# EAGLE schematic All-in-one Starter Kit for Pico 2V 1.0(1) (EAGLE 9.5.1)
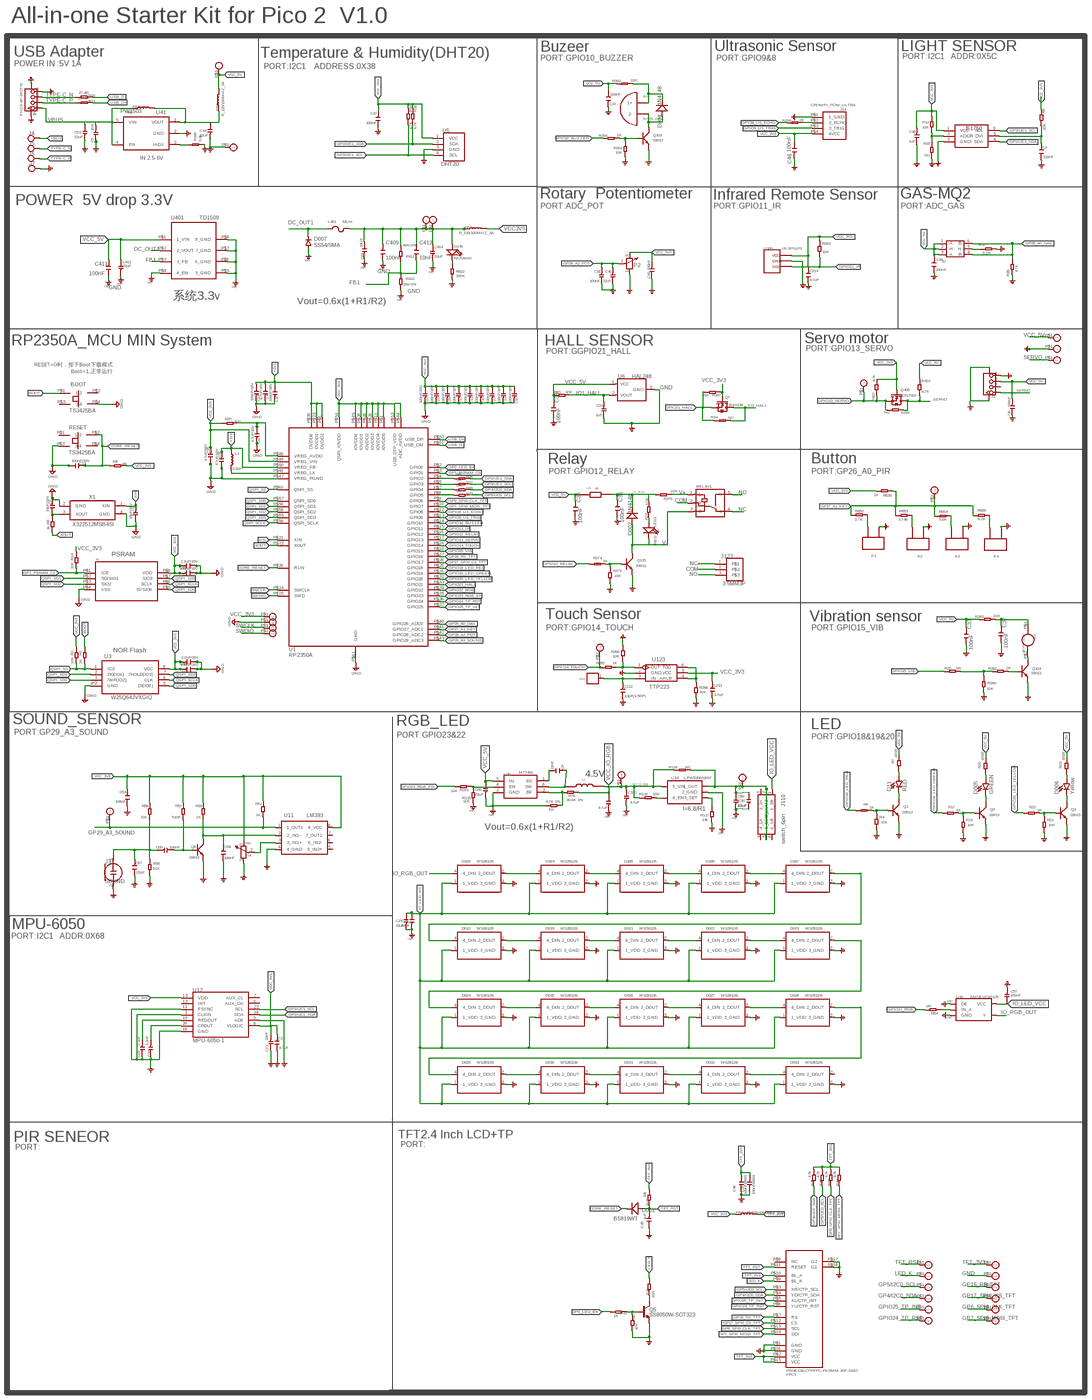
[diagram p0: schematic, sheet 1, overview]
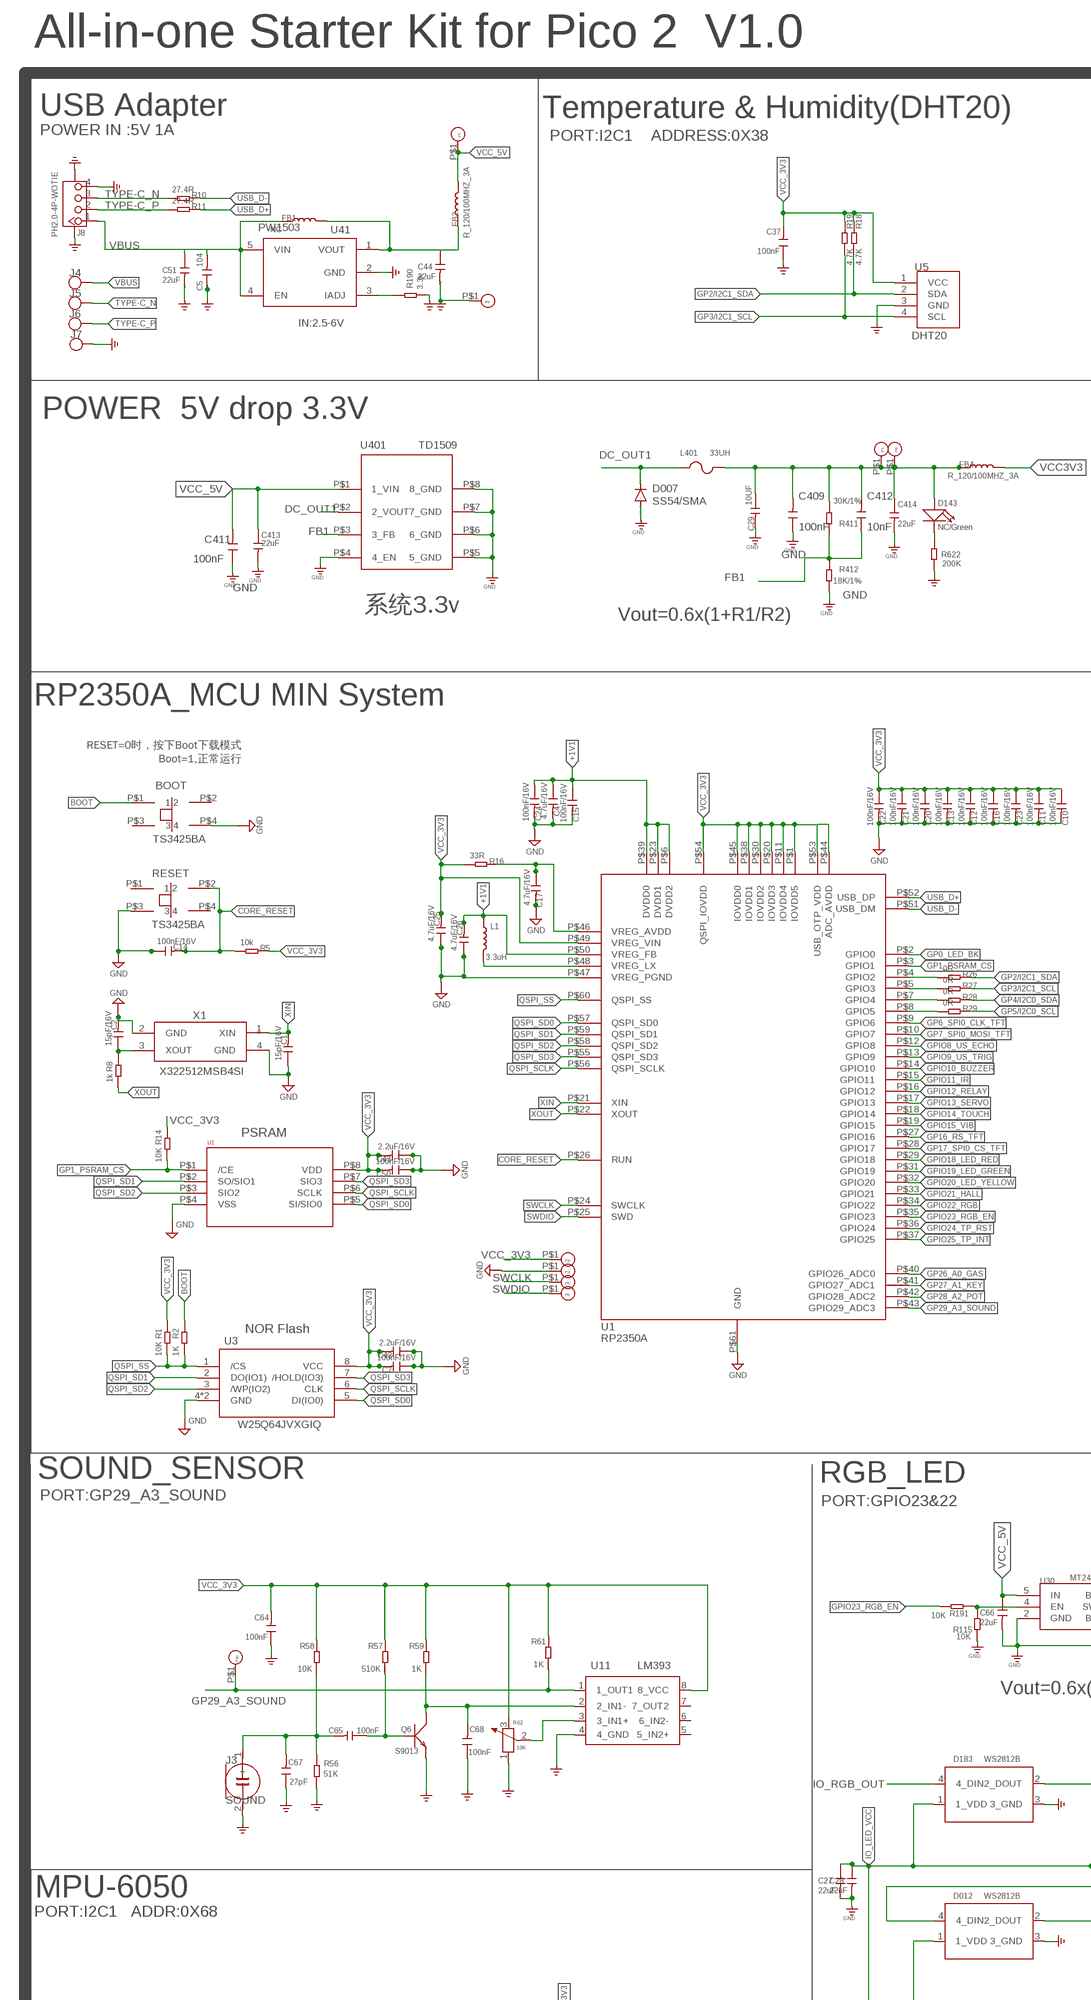
[diagram p1: schematic, sheet 1, part 1 of 4]
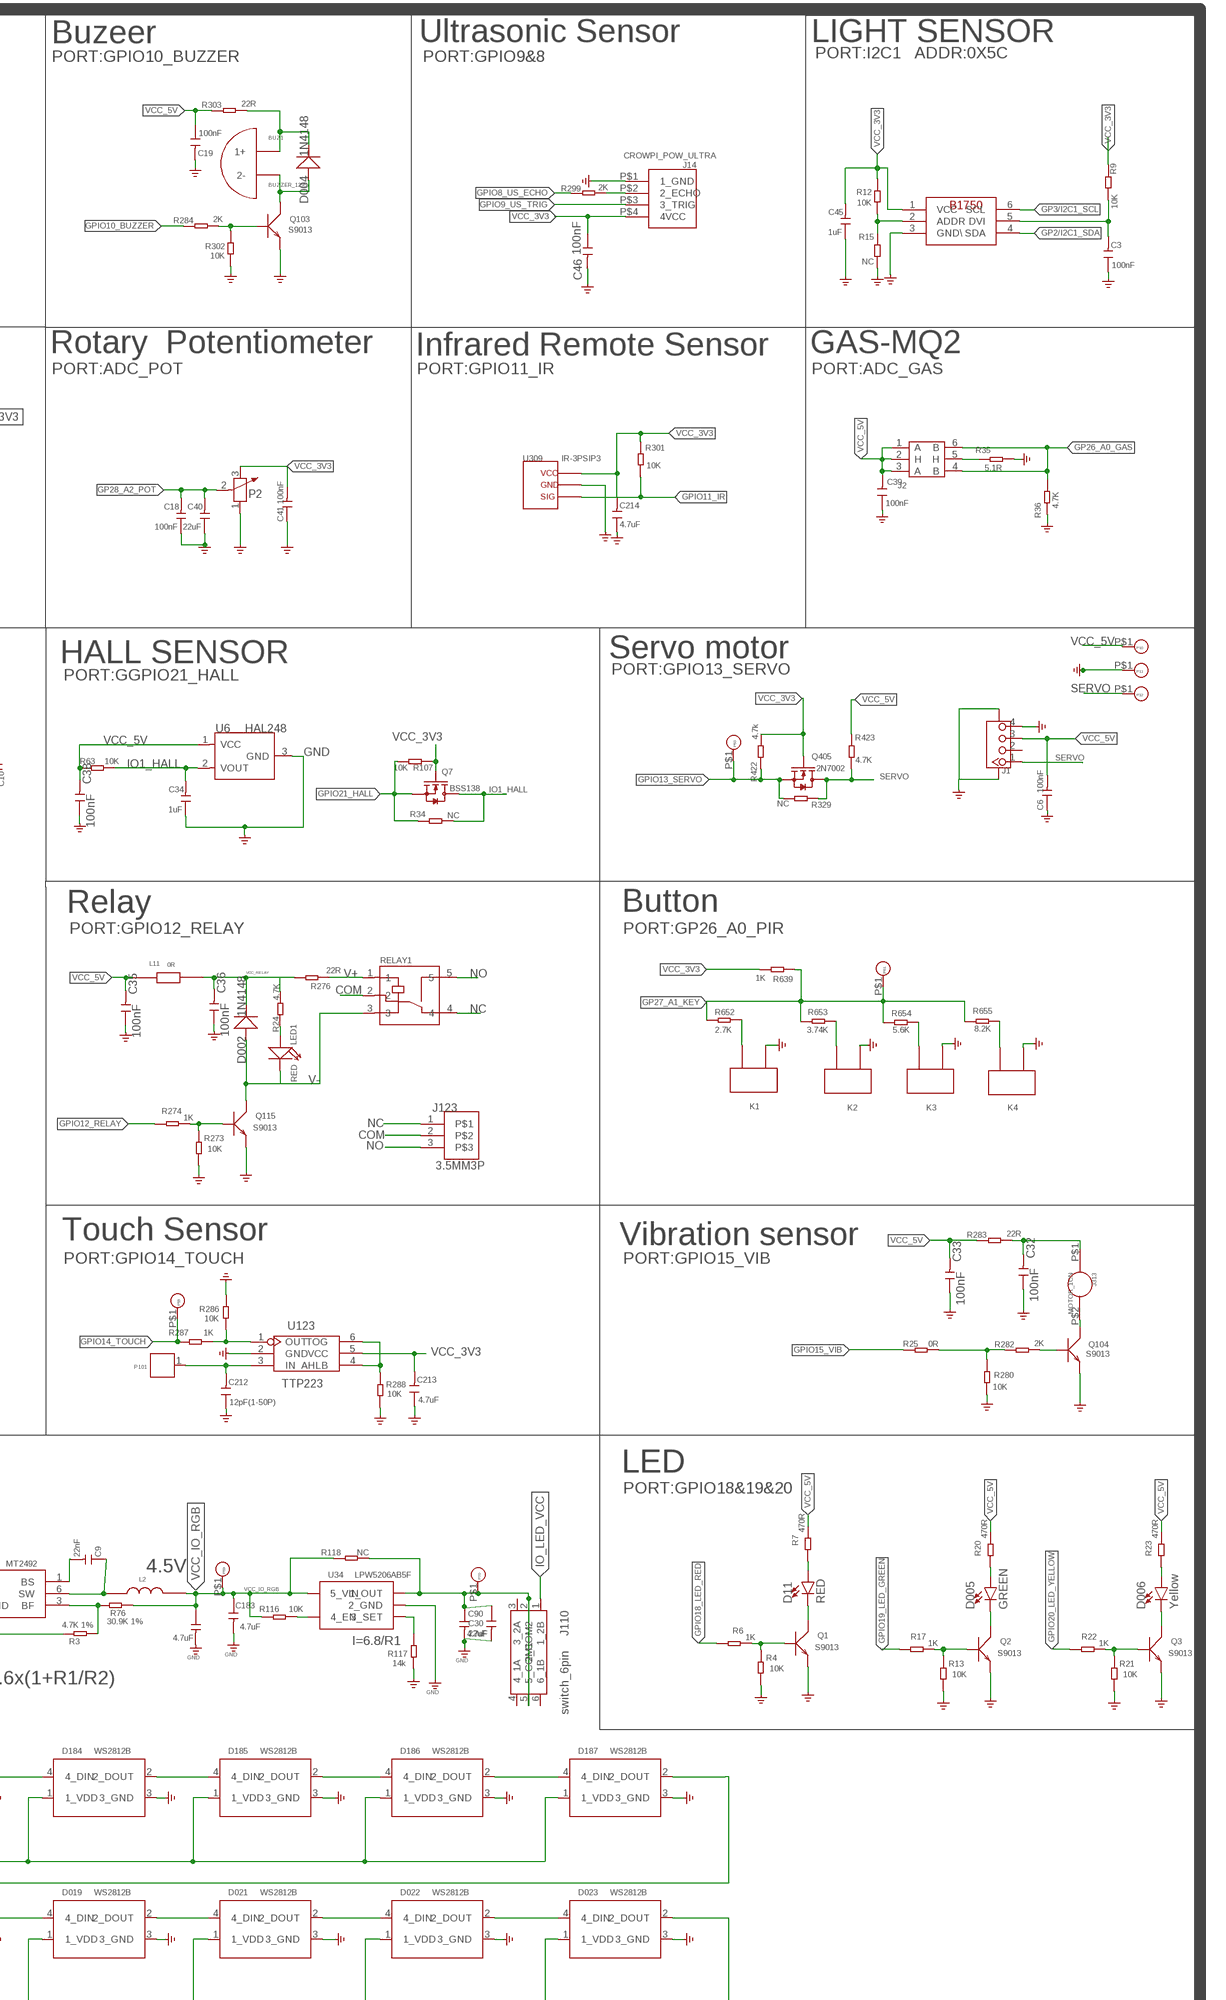
[diagram p2: schematic, sheet 1, part 2 of 4]
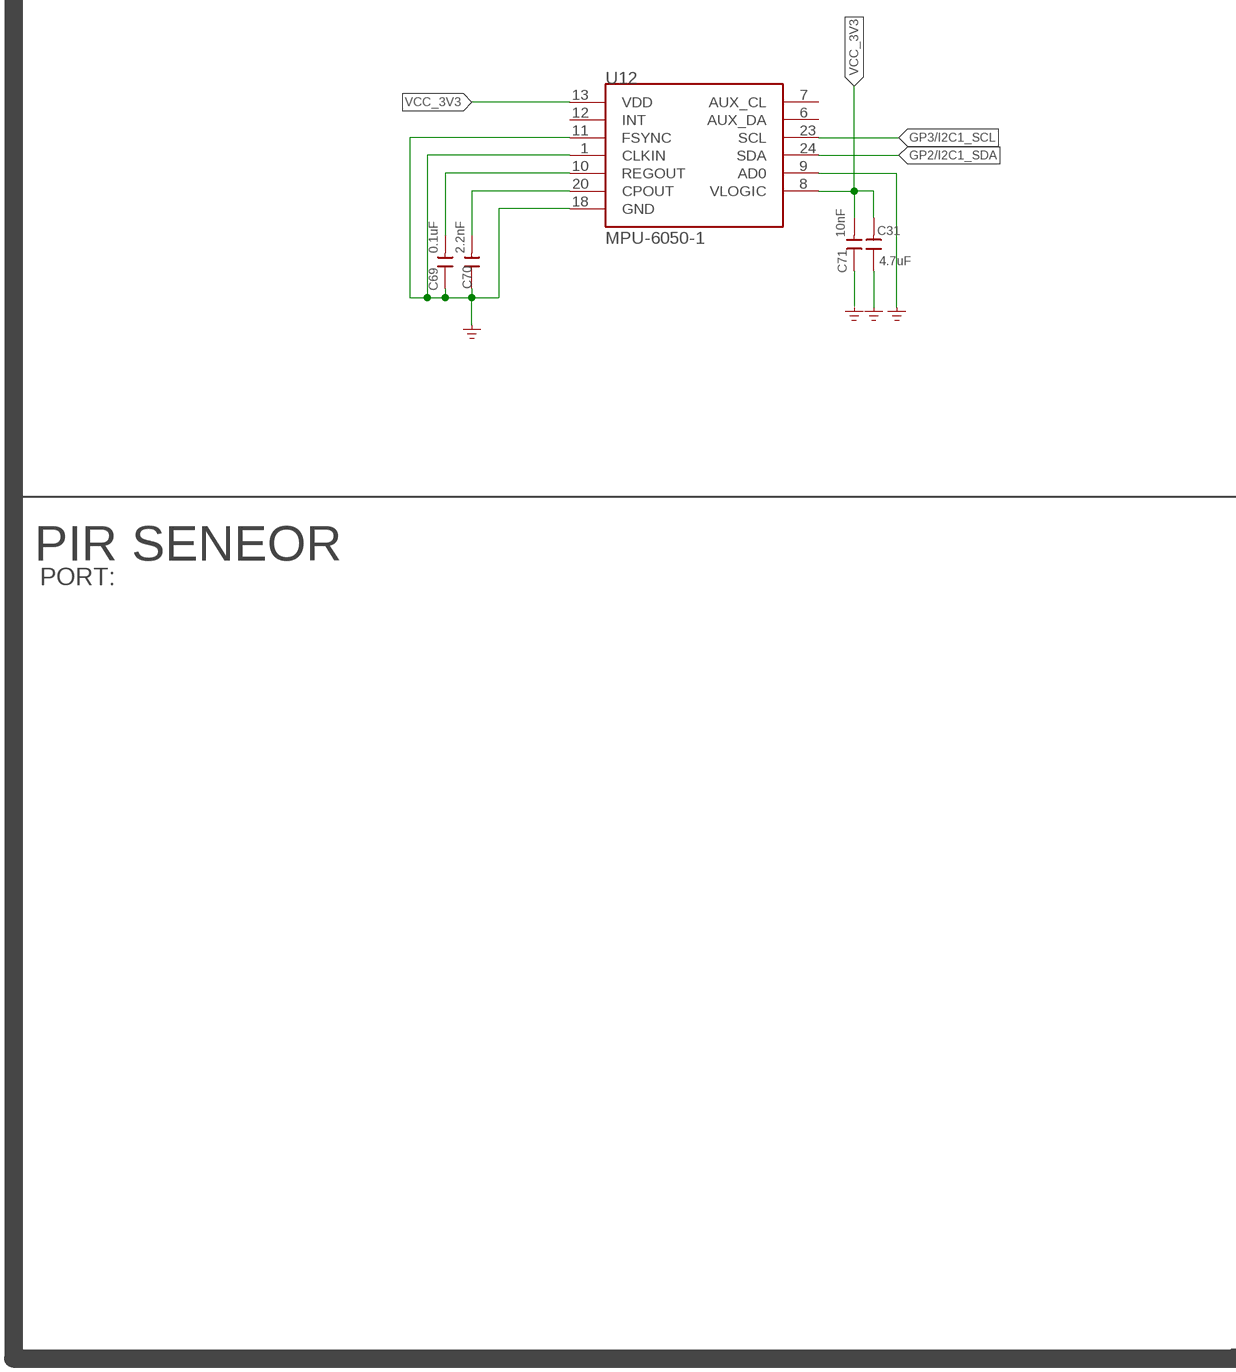
[diagram p3: schematic, sheet 1, part 3 of 4]
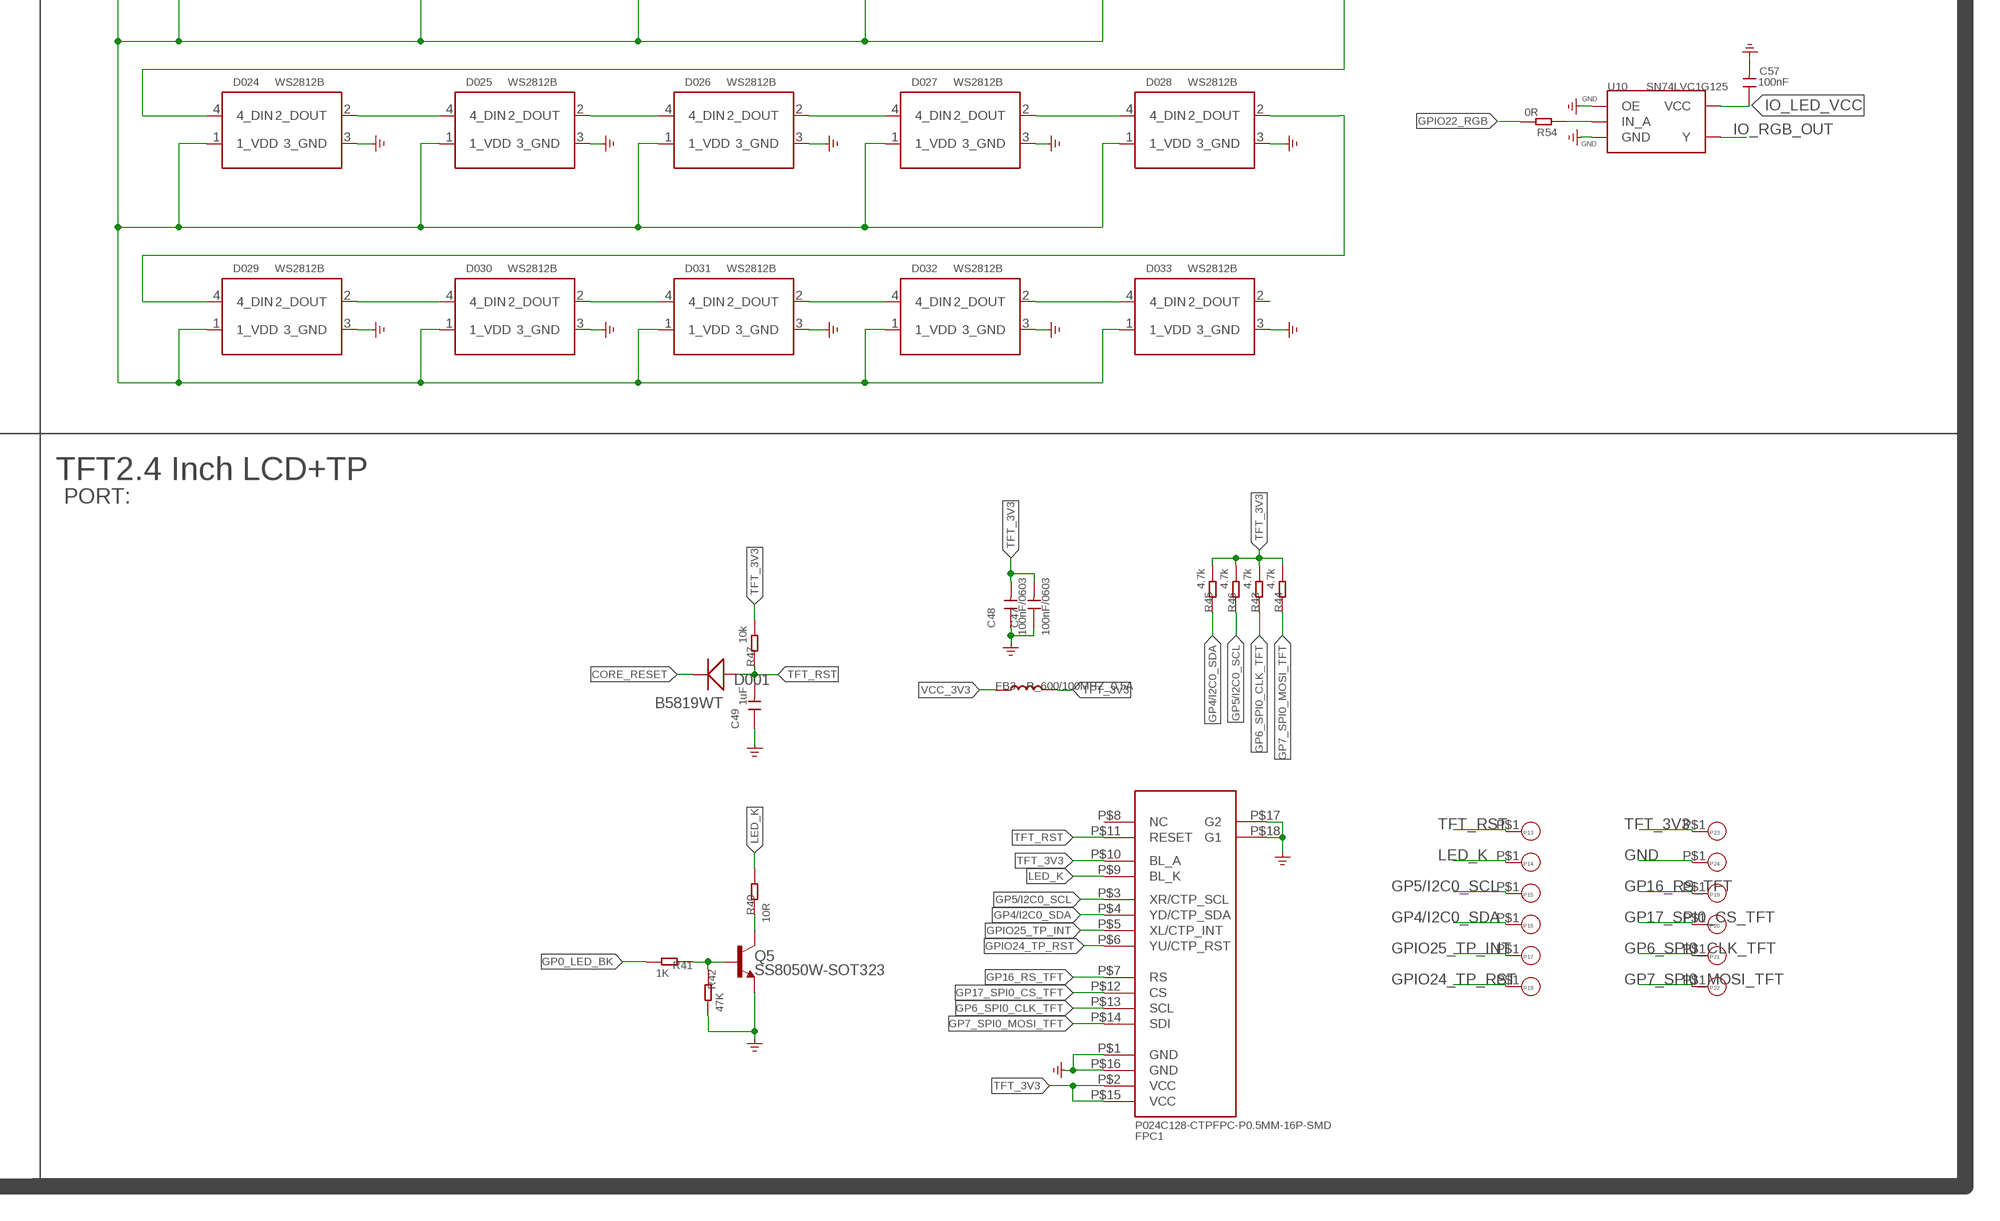
[diagram p4: schematic, sheet 1, part 4 of 4]

## Parts
BOOT  TS3425BA  KEY  [SMD_KEY4.2*3.*.2.5]
BUZ1  BUZZER_1295  BUZZERBUZZER_1295_DIP  [BUZZER-D12MM-DIP2]
C1  15pF/16V  CAPC0603  [C0603]
C2  15pF/16V  CAPC0603  [C0603]
C3  100nF  CAPC0603  [C0603]
C4  4.7uF/16V  CAPC0603  [C0603]
C5  104  CAPC0805  [C0805]
C6  100nF  CAPC0603  [C0603]
C7  100nF/16V  CAPC0603  [C0603]
C8  4.7uF  CAPC0603  [C0603]
C9  22nF  CAPC0603  [C0603]
C10  100nF/16V  CAPC0603  [C0603]
C11  100nF/16V  CAPC0603  [C0603]
C12  100nF/16V  CAPC0603  [C0603]
C13  100nF/16V  CAPC0603  [C0603]
C14  100nF/16V  CAPC0603  [C0603]
C15  100nF/16V  CAPC0603  [C0603]
C16  100nF/16V  CAPC0603  [C0603]
C17  4.7uF/16V  CAPC0603  [C0603]
C18  100nF  CAPC0603  [C0603]
C19  100nF  CAPC0603  [C0603]
C20  100nF/16V  CAPC0603  [C0603]
C21  100nF/16V  CAPC0603  [C0603]
C22  100nF/16V  CAPC0603  [C0603]
C23  100nF/16V  CAPC0603  [C0603]
C24  100nF/16V  CAPC0603  [C0603]
C25  4.7uF/16V  CAPC0603  [C0603]
C26  4.7uF/16V  CAPC0603  [C0603]
C27  22uF  CAPC0805  [C0805]
C28  22uF  CAPC0805  [C0805]
C29  10UF  CAPC0805  [C0805]
C30  22uF  CAPC0805  [C0805]
C31  4.7uF  CAPC0603  [C0603]
C32  100nF  CAPC0603  [C0603]
C33  100nF  CAPC0603  [C0603]
C34  1uF  CAPC0603  [C0603]
C35  100nF  CAPC0603  [C0603]
C36  100nF  CAPC0603  [C0603]
C37  100nF  CAPC0603  [C0603]
C38  100nF  CAPC0603  [C0603]
C39  100nF  CAPC0603  [C0603]
C40  22uF  CAPC0603  [C0603]
C41  100nF  CAPC0603  [C0603]
C42  2.2uF/16V  CAPC0603  [C0603]
C43  2.2uF/16V  CAPC0603  [C0603]
C44  22uF  CAPC0805  [C0805]
C45  1uF  CAPC0603  [C0603]
C46  100nF  CAPC0603  [C0603]
C47  100nF/0603  CAPC0603  [C0603]
C48  100nF/0603  CAPC0603  [C0603]
C49  1uF  CAPC0603  [C0603]
C50  100nF/16V  CAPC0603  [C0603]
C51  22uF  CAPC0805  [C0805]
C57  100nF  CAPC0603  [C0603]
C64  100nF  CAPC0603  [C0603]
C65  100nF  CAPC0603  [C0603]
C66  22uF  CAPC0805  [C0805]
C67  27pF  CAPC0603  [C0603]
C68  100nF  CAPC0603  [C0603]
C69  0.1uF  CAPC0603  [C0603]
C70  2.2nF  CAPC0603  [C0603]
C71  10nF  CAPC0603  [C0603]
C90  4.7uF  CAPC0603  [C0603]
C183  4.7uF  CAPC0603  [C0603]
C212  12pF(1-50P)  CAPC0603  [C0603]
C213  4.7uF  CAPC0603  [C0603]
C214  4.7uF  CAPC0603  [C0603]
C409  100nF  CAPC0603  [C0603]
C411  100nF  CAPC0603  [C0603]
C412  10nF  CAPC0603  [C0603]
C413  22uF  CAPC0805  [C0805]
C414  22uF  CAPC0805  [C0805]
D001  B5819WT  DIODE0603  [D_SOD523]
D002  1N4148  DIODE1206  [D_SOD123]
D004  1N4148  DIODE1206  [D_SOD123]
D005  GREEN  LED  [LED-8MM]
D006  Yellow  LED  [LED-8MM]
D007  SS54/SMA  DIODE_DIODE-DO-214AC  [DIODE_DO-214AC]
D11  RED  LED  [LED-8MM]
D012  WS2812B  LED_RGB_WS2812_3535  [LED_RGB_WS2812_3535]
D019  WS2812B  LED_RGB_WS2812_3535  [LED_RGB_WS2812_3535]
D021  WS2812B  LED_RGB_WS2812_3535  [LED_RGB_WS2812_3535]
D022  WS2812B  LED_RGB_WS2812_3535  [LED_RGB_WS2812_3535]
D023  WS2812B  LED_RGB_WS2812_3535  [LED_RGB_WS2812_3535]
D024  WS2812B  LED_RGB_WS2812_3535  [LED_RGB_WS2812_3535]
D025  WS2812B  LED_RGB_WS2812_3535  [LED_RGB_WS2812_3535]
D026  WS2812B  LED_RGB_WS2812_3535  [LED_RGB_WS2812_3535]
D027  WS2812B  LED_RGB_WS2812_3535  [LED_RGB_WS2812_3535]
D028  WS2812B  LED_RGB_WS2812_3535  [LED_RGB_WS2812_3535]
D029  WS2812B  LED_RGB_WS2812_3535  [LED_RGB_WS2812_3535]
D030  WS2812B  LED_RGB_WS2812_3535  [LED_RGB_WS2812_3535]
D031  WS2812B  LED_RGB_WS2812_3535  [LED_RGB_WS2812_3535]
D032  WS2812B  LED_RGB_WS2812_3535  [LED_RGB_WS2812_3535]
D033  WS2812B  LED_RGB_WS2812_3535  [LED_RGB_WS2812_3535]
D143  NC/Green  LED_0603_SMT  [LED_0603_SMT]
D183  WS2812B  LED_RGB_WS2812_3535  [LED_RGB_WS2812_3535]
D184  WS2812B  LED_RGB_WS2812_3535  [LED_RGB_WS2812_3535]
D185  WS2812B  LED_RGB_WS2812_3535  [LED_RGB_WS2812_3535]
D186  WS2812B  LED_RGB_WS2812_3535  [LED_RGB_WS2812_3535]
D187  WS2812B  LED_RGB_WS2812_3535  [LED_RGB_WS2812_3535]
FB1  NC  R_120/100MHZ_3A  [L0805]
FB2  R_120/100MHZ_3A  [L0805]
FB3  R_600/100MHZ_0.5A  [L0603]
FB4  R_120/100MHZ_3A  [L0805]
FPC1  P024C128-CTPFPC-P0.5MM-16P-SMD  [FPC-P0.5MM-16P-SMD]
J1  A_XBJ_CONNECTOR_TWIG-4P-2.0-SMD-FEMALE-REINFORCE90D  [A_XBJ_CONNECTOR_4P-SMD-2.0-90D]
J2  MQ-SOCKET  [MQ2]
J3  SOUND  TEMPLATE_MICROPHONE  [TEMPLATE_2P-D8.9MM]
J4  TP-SMDTP-SMD-2X4MM  [TP-SMD-2X4MM]
J5  TP-SMDTP-SMD-2X4MM  [TP-SMD-2X4MM]
J6  TP-SMDTP-SMD-2X4MM  [TP-SMD-2X4MM]
J7  TP-SMDTP-SMD-2X4MM  [TP-SMD-2X4MM]
J8  PH2.0-4P-WOTIE  [PH2.0-4P]
J14  CROWPI_POW_ULTRA  [CROWPI_POW_ULTRA]
J110  switch_6pin  SWITCH_6PIN_2P  [SWITCH_6PIN_2P]
J123  3.5MM3P  [3.5MM*3P]
J313  MOTOR_1CN  [MOTOR_1CM]
K1  BUTTON_2P  [BUTTON_2P]
K2  BUTTON_2P  [BUTTON_2P]
K3  BUTTON_2P  [BUTTON_2P]
K4  BUTTON_2P  [BUTTON_2P]
L1  3.3uH  FTC201610S3R3MBCA  [SMD,1.6X2MM]
L2  CD32_950MA  [CD32]
L11  0R  CMP201209UD1R0MT201209  [201209]
L401  33UH  L-773  [L773]
LED1  RED  DISCRETE_LED0603  [DISCRETE_LED-0603]
P1  PADPAD-1.0MM  [PAD-1.0MM]
P2  R-POTENTIOMETER  [3P-SQUA-45.6X10X5.8H]
P3  PADPAD-1.0MM  [PAD-1.0MM]
P4  PADPAD-1.0MM  [PAD-1.0MM]
P5  PADPAD-1.0MM  [PAD-1.0MM]
P6  PADPAD-1.0MM  [PAD-1.0MM]
P7  PADPAD-1.0MM  [PAD-1.0MM]
P8  PADPAD-1.0MM  [PAD-1.0MM]
P9  PADPAD-1.0MM  [PAD-1.0MM]
P10  PADPAD-1.0MM  [PAD-1.0MM]
P11  PADPAD-1.0MM  [PAD-1.0MM]
P12  PADPAD-1.0MM  [PAD-1.0MM]
P13  PADPAD-1.0MM  [PAD-1.0MM]
P14  PADPAD-1.0MM  [PAD-1.0MM]
P15  PADPAD-1.0MM  [PAD-1.0MM]
P16  PADPAD-1.0MM  [PAD-1.0MM]
P17  PADPAD-1.0MM  [PAD-1.0MM]
P18  PADPAD-1.0MM  [PAD-1.0MM]
P19  PADPAD-1.0MM  [PAD-1.0MM]
P20  PADPAD-1.0MM  [PAD-1.0MM]
P21  PADPAD-1.0MM  [PAD-1.0MM]
P22  PADPAD-1.0MM  [PAD-1.0MM]
P23  PADPAD-1.0MM  [PAD-1.0MM]
P24  PADPAD-1.0MM  [PAD-1.0MM]
P30  PADPAD-1.0MM  [PAD-1.0MM]
P53  PADPAD-1.0MM  [PAD-1.0MM]
P55  PADPAD-1.0MM  [PAD-1.0MM]
P61  PADPAD-1.0MM  [PAD-1.0MM]
P69  PADPAD-1.0MM  [PAD-1.0MM]
P70  PADPAD-1.0MM  [PAD-1.0MM]
P101  KEY  PAD'D450MIL'  [1P-D450]
Q1  S9013  TRANSISTOR-NPN-SOT23  [SOT23@1]
Q2  S9013  TRANSISTOR-NPN-SOT23  [SOT23@1]
Q3  S9013  TRANSISTOR-NPN-SOT23  [SOT23@1]
Q5  SS8050W-SOT323  TRANS_NPN  [MOS_SOT323]
Q6  S9013  TRANSISTOR-NPN-SOT23  [SOT23@1]
Q7  BSS138  MOSFET-N'SOT23'  [SOT23]
Q103  S9013  TRANSISTOR-NPN-SOT23  [SOT23@1]
Q104  S9013  TRANSISTOR-NPN-SOT23  [SOT23@1]
Q115  S9013  TRANSISTOR-NPN-SOT23  [SOT23@1]
Q405  2N7002  MOSFET-N'SOT23'  [SOT23]
R1  10K  RESR0603  [R0603]
R2  1K  RESR0603  [R0603]
R3  4.7K 1%  RESR0603  [R0603]
R4  10K  RESR0603  [R0603]
R5  10k  RESR0603  [R0603]
R6  1K  RESR0603  [R0603]
R7  470R  RESR0603  [R0603]
R8  1k  RESR0603  [R0603]
R9  10K  RESR0603  [R0603]
R10  27.4R  RESR0603  [R0603]
R11  27.4R  RESR0603  [R0603]
R12  10K  RESR0603  [R0603]
R13  10K  RESR0603  [R0603]
R14  10K  RESR0603  [R0603]
R15  NC  RESR0603  [R0603]
R16  33R  RESR0603  [R0603]
R17  1K  RESR0603  [R0603]
R18  4.7K  RESR0603  [R0603]
R19  4.7K  RESR0603  [R0603]
R20  470R  RESR0603  [R0603]
R21  10K  RESR0603  [R0603]
R22  1K  RESR0603  [R0603]
R23  470R  RESR0603  [R0603]
R24  4.7K  RESR0603  [R0603]
R25  0R  RESR0603  [R0603]
R26  0R  RESR0603  [R0603]
R27  0R  RESR0603  [R0603]
R28  0R  RESR0603  [R0603]
R29  0R  RESR0603  [R0603]
R34  NC  RESR0603  [R0603]
R35  5.1R  RESR0603  [R0603]
R36  4.7K  RESR0603  [R0603]
R40  10R  RESR0603  [R0603]
R41  1K  RESR0603  [R0603]
R42  47K  RESR0603  [R0603]
R43  4.7k  RESR0603  [R0603]
R44  4.7k  RESR0603  [R0603]
R45  4.7k  RESR0603  [R0603]
R46  4.7k  RESR0603  [R0603]
R47  10k  RESR0603  [R0603]
R54  0R  RESR0603  [R0603]
R56  51K  RESR0603  [R0603]
R57  510K  RESR0603  [R0603]
R58  10K  RESR0603  [R0603]
R59  1K  RESR0603  [R0603]
R61  1K  RESR0603  [R0603]
R62  10K  R-POTENTIOMETER-SMD  [3P-SMD-SQUA-3.6X3.3]
R63  10K  RESR0603  [R0603]
R76  30.9K 1%  RESR0603  [R0603]
R107  10K  RESR0603  [R0603]
R115  10K  RESR0603  [R0603]
R116  10K  RESR0603  [R0603]
R117  14k  RESR0603  [R0603]
R118  NC  RESR0603  [R0603]
R190  3.3k  RESR0603  [R0603]
R191  10K  RESR0603  [R0603]
R273  10K  RESR0603  [R0603]
R274  1K  RESR0603  [R0603]
R276  22R  RESR0603  [R0603]
R280  10K  RESR0603  [R0603]
R282  2K  RESR0603  [R0603]
R283  22R  RESR0603  [R0603]
R284  2K  RESR0603  [R0603]
R286  10K  RESR0603  [R0603]
R287  1K  RESR0603  [R0603]
R288  10K  RESR0603  [R0603]
R299  2K  RESR0603  [R0603]
R301  10K  RESR0603  [R0603]
R302  10K  RESR0603  [R0603]
R303  22R  RESR0603  [R0603]
R329  NC  RESR0603  [R0603]
R411  30K/1%  RESR0603  [R0603]
R412  18K/1%  RESR0603  [R0603]
R422  4.7k  RESR0603  [R0603]
R423  4.7K  RESR0603  [R0603]
R622  200K  RESR0603  [R0603]
R639  1K  RESR0603  [R0603]
R652  2.7K  RESR0603  [R0603]
R653  3.74K  RESR0603  [R0603]
R654  5.6K  RESR0603  [R0603]
R655  8.2K  RESR0603  [R0603]
RELAY1  RELAY-SRD  [REY5-6-19.1X15.5X15.3MM]
RESET  TS3425BA  KEY  [SMD_KEY4.2*3.*.2.5]
U1  RP2350A  [QFN-60_7X7MM]
U2  APS6404L  [SOP-8L]
U3  W25Q64JVXGIQ  W25QXX  [W25QXX-XSON-8-EP(4X4)]
U5  DHT20  CROWTAIL-DHT20-V1.0-20211013_DHT20  [CROWTAIL-DHT20-V1.0-20211013_DHT20]
U6  HAL248  A1101  [SOT-23W]
U7  BH1750  [BH1750-WSOF-6]
U10  SN74LVC1G125  [SOT23-5]
U11  LM393  IC_LM393_SOP8  [SOP8@1]
U12  MPU-6050-1  [QFN-24-4MM2]
U30  MT2492  [MT2492-SOT23-6]
U34  LPW5206AB5F  LPW5206B5F_SOT23-5  [IC_SOT23-5]
U41  PW1503  [SOT23-5]
U123  TTP223  [SOT23-6L]
U309  IR-3PSIP3  [VS1838B-SIP3]
U401  TD1509  [TD1509]
X1  X322512MSB4SI  A_XBJ_XTAL  [A_XBJ_SMD3225]

## Nets
+1V1 [PWR]: C4.1 C15.1 C24.1 C26.2 L1.P$1 U1.P$6(DVDD2) U1.P$23(DVDD1) U1.P$39(DVDD0) U1.P$50(VREG_FB)
BOOT: BOOT.P$1 R2.2
COM: J123.2 RELAY1.2
CORE_RESET: C14.2 D001.- R5.1 RESET.P$2 U1.P$26(RUN)
DC_OUT1 [PWR]: D007.C L401.1 U401.P$2(2_VOUT)
FB1: C412.1 R411.1 R412.2 U401.P$3(3_FB)
GND [PWR]: BOOT.P$4 C1.1 C2.2 C3.1 C4.2 C5.1 C6.1 C7.1 C8.2 C10.2 C11.2 C12.2 C13.2 C14.1 C15.2 C16.2 C17.2 C18.1 C19.2 C20.2 C21.2 C22.2 C23.2 C24.2 C25.1 C26.1 C27.2 C28.2 C29.2 C30.2 C31.1 C32.1 C33.1 C34.1 C35.1 C36.1 C37.1 C38.1 C39.1 C40.1 C41.1 C42.1 C43.1 C44.2 C45.1 C46.2 C47.1 C48.1 C49.1 C50.1 C51.2 C57.2 C64.1 C66.2 C67.1 C68.1 C69.1 C70.1 C71.1 C90.2 C183.2 C212.1 C213.1 C214.1 C409.1 C411.1 C413.2 C414.2 D007.A D012.3(3_GND) D019.3(3_GND) D021.3(3_GND) D022.3(3_GND) D023.3(3_GND) D024.3(3_GND) D025.3(3_GND) D026.3(3_GND) D027.3(3_GND) D028.3(3_GND) D029.3(3_GND) D030.3(3_GND) D031.3(3_GND) D032.3(3_GND) D033.3(3_GND) D183.3(3_GND) D184.3(3_GND) D185.3(3_GND) D186.3(3_GND) D187.3(3_GND) FPC1.P$1(GND) FPC1.P$16(GND) FPC1.P$17(G2) FPC1.P$18(G1) J1.4 J1.SS1 J1.SS2 J3.2(-) J7.1 J8.4 J8.5(SS1) J8.6(SS2) J14.P$1(1_GND) K1.P$1 K2.P$1 K3.P$1 K4.P$1 P2.1 P4.P$1 P9.P$1 P11.P$1 P24.P$1 Q1.2(E) Q2.2(E) Q3.2(E) Q5.2(E) Q6.2(E) Q103.2(E) Q104.2(E) Q115.2(E) R3.1 R4.1 R13.1 R15.1 R21.1 R35.1 R36.2 R42.2 R56.2 R62.1 R115.2 R117.2 R190.2 R273.1 R280.1 R286.2 R288.2 R302.1 R412.1 R622.2 RESET.P$3 U1.P$47(VREG_PGND) U1.P$61(GND) U2.P$4(VSS) U3.4(GND) U3.EP(GND) U5.3(GND) U6.3(GND) U7.3(GND\) U10.1(OE) U10.3(GND) U11.4(4_GND) U12.1(CLKIN) U12.9(AD0) U12.11(FSYNC) U12.18(GND) U30.2(GND) U34.2(2_GND) U41.2(GND) U123.2(GND) U309.2 U401.P$4(4_EN) U401.P$5(5_GND) U401.P$6(6_GND) U401.P$7(7_GND) U401.P$8(8_GND) X1.2(GND) X1.4(GND) ; supply symbol labelled POWER-OR-GND-_GND_POWER
GP0_LED_BK: R41.2 U1.P$2(GPIO0)
GP1_PSRAM_CS: R14.1 U1.P$3(GPIO1) U2.P$1(/CE)
GP2/I2C1_SDA: R18.2 R26.2 U5.2(SDA) U7.4(SDA) U12.24(SDA)
GP3/I2C1_SCL: R19.2 R27.2 U5.4(SCL) U7.6(SCL) U12.23(SCL)
GP4/I2C0_SDA: FPC1.P$4(YD/CTP_SDA) P16.P$1 R28.2 R45.1
GP5/I2C0_SCL: FPC1.P$3(XR/CTP_SCL) P15.P$1 R29.2 R46.1
GP6_SPI0_CLK_TFT: FPC1.P$13(SCL) P21.P$1 R43.1 U1.P$9(GPIO6)
GP7_SPI0_MOSI_TFT: FPC1.P$14(SDI) P22.P$1 R44.1 U1.P$10(GPIO7)
GP16_RS_TFT: FPC1.P$7(RS) P19.P$1 U1.P$27(GPIO16)
GP17_SPI0_CS_TFT: FPC1.P$12(CS) P20.P$1 U1.P$28(GPIO17)
GP26_A0_GAS: J2.4(B) J2.6(B) R36.1 U1.P$40(GPIO26_ADC0)
GP27_A1_KEY: P61.P$1 R639.2 R652.2 R653.2 R654.2 R655.2 U1.P$41(GPIO27_ADC1)
GP28_A2_POT: C18.2 C40.2 P2.2 U1.P$42(GPIO28_ADC2)
GP29_A3_SOUND: P30.P$1 R61.1 U1.P$43(GPIO29_ADC3) U11.1(1_OUT1)
GPIO8_US_ECHO: R299.2 U1.P$12(GPIO8)
GPIO9_US_TRIG: J14.P$3(3_TRIG) U1.P$13(GPIO9)
GPIO10_BUZZER: R284.1 U1.P$14(GPIO10)
GPIO11_IR: R301.2 U1.P$15(GPIO11) U309.3
GPIO12_RELAY: R274.2 U1.P$16(GPIO12)
GPIO13_SERVO: P53.P$1 Q405.2(S) R329.2 R422.1 U1.P$17(GPIO13)
GPIO14_TOUCH: P55.P$1 R287.2 U1.P$18(GPIO14)
GPIO15_VIB: R25.2 U1.P$19(GPIO15)
GPIO18_LED_RED: R6.2 U1.P$29(GPIO18)
GPIO19_LED_GREEN: R17.2 U1.P$31(GPIO19)
GPIO20_LED_YELLOW: R22.2 U1.P$32(GPIO20)
GPIO21_HALL: Q7.2(S) R34.1 R107.1 U1.P$33(GPIO21)
GPIO22_RGB: R54.1 U1.P$34(GPIO22)
GPIO23_RGB_EN: R191.1 U1.P$35(GPIO23)
GPIO24_TP_RST: FPC1.P$6(YU/CTP_RST) P18.P$1 U1.P$36(GPIO24)
GPIO25_TP_INT: FPC1.P$5(XL/CTP_INT) P17.P$1 U1.P$37(GPIO25)
IN1: C212.2 P101.1 U123.3(IN)
IO0_VIB: R25.1 R280.2 R282.1
IO1_HALL: C34.2 Q7.3(D) R34.2 R63.1 U6.2(VOUT)
IO_LED_V [PWR]: C30.1 C90.1 J110.2(2_COM2) J110.5(5_COM1) P70.P$1 R118.2 U34.1(1_OUT)
IO_LED_VCC [PWR]: C27.1 C28.1 C57.1 D012.1(1_VDD) D019.1(1_VDD) D021.1(1_VDD) D022.1(1_VDD) D023.1(1_VDD) D024.1(1_VDD) D025.1(1_VDD) D026.1(1_VDD) D027.1(1_VDD) D028.1(1_VDD) D029.1(1_VDD) D030.1(1_VDD) D031.1(1_VDD) D032.1(1_VDD) D033.1(1_VDD) D183.1(1_VDD) D184.1(1_VDD) D185.1(1_VDD) D186.1(1_VDD) D187.1(1_VDD) J110.1(1_2B) U10.5(VCC)
IO_RGB_OUT: D183.4(4_DIN) U10.4(Y)
IO_RGB_OUT1: D012.4(4_DIN) D187.2(2_DOUT)
IO_RGB_OUT2: D023.2(2_DOUT) D024.4(4_DIN)
IO_RGB_OUT3: D028.2(2_DOUT) D029.4(4_DIN)
LED_K: FPC1.P$9(BL_K) P14.P$1 R40.2
N$1: D012.2(2_DOUT) D019.4(4_DIN)
N$2: C2.1 R8.2 X1.3(XOUT)
N$3: D019.2(2_DOUT) D021.4(4_DIN)
N$4: R26.1 U1.P$4(GPIO2)
N$5: Q2.1(B) R13.2 R17.1
N$6: C17.1 R16.2 U1.P$46(VREG_AVDD)
N$7: D005.2(C) Q2.3(C)
N$8: R27.1 U1.P$5(GPIO3)
N$9: C3.2 R9.2 U7.5(DVI)
N$10: D005.1(A) R20.2
N$11: Q3.1(B) R21.2 R22.1
N$12: L1.P$2 U1.P$48(VREG_LX)
N$13: D021.2(2_DOUT) D022.4(4_DIN)
N$14: Q1.1(B) R4.2 R6.1
N$15: D11.2(C) Q1.3(C)
N$16: D11.1(A) R7.2
N$17: D006.2(C) Q3.3(C)
N$18: D006.1(A) R23.2
N$19: LED1.+ R24.1
N$20: D022.2(2_DOUT) D023.4(4_DIN)
N$21: Q5.1(B) R41.1 R42.1
N$22: D024.2(2_DOUT) D025.4(4_DIN)
N$23: J2.1(A)
N$24: J2.5(H) R35.2
N$25: D025.2(2_DOUT) D026.4(4_DIN)
N$26: D026.2(2_DOUT) D027.4(4_DIN)
N$27: D027.2(2_DOUT) D028.4(4_DIN)
N$29: D029.2(2_DOUT) D030.4(4_DIN)
N$30: D030.2(2_DOUT) D031.4(4_DIN)
N$31: D031.2(2_DOUT) D032.4(4_DIN)
N$32: D032.2(2_DOUT) D033.4(4_DIN)
N$34: R28.1 U1.P$7(GPIO4)
N$35: R12.1 R15.2 U7.2(ADDR)
N$43: R190.1 U41.3(IADJ)
N$47: R29.1 U1.P$8(GPIO5)
N$48: J313.P$2 Q104.3(C)
N$49: Q5.3(C) R40.1
N$72: R54.2 U10.2(IN_A)
N$78: C65.1 Q6.1(B) R57.1
N$79: C68.2 Q6.3(C) R59.1 U11.2(2_IN1-)
N$80: R62.2 U11.3(3_IN1+)
N$81: C65.2 C67.2 J3.1(+) R56.1 R58.1
N$82: C69.2 U12.10(REGOUT)
N$83: C70.2 U12.20(CPOUT)
N$133: D143.2(2_K) R622.1
N$164: R115.1 R191.2 U30.4(EN)
N$166: K1.P$2 R652.1
N$168: K2.P$2 R653.1
N$169: K3.P$2 R654.1
N$172: K4.P$2 R655.1
N$176: C9.1 L2.1 U30.6(SW)
N$178: R3.2 R76.1 U30.3(BF)
N$179: C9.2 U30.1(BS)
N$181: R117.1 U34.3(3_SET)
N$183: R116.1 U34.4(4_EN)
N$259: Q115.1(B) R273.2 R274.1
N$263: C32.2 J313.P$1 R283.2
N$264: R288.1 U123.4(AHLB) U123.6(TOG)
N$266: Q104.1(B) R282.2
N$267: R286.1 R287.1 U123.1(OUT)
N$278: J14.P$2(2_ECHO) R299.1
N$279: Q103.1(B) R284.2 R302.2
N$280: BUZ1.2(2-) D004.+ Q103.3(C)
N$281: BUZ1.1(1+) D004.- R303.2
N$446: D183.2(2_DOUT) D184.4(4_DIN)
N$447: D184.2(2_DOUT) D185.4(4_DIN)
N$448: D185.2(2_DOUT) D186.4(4_DIN)
N$449: D186.2(2_DOUT) D187.4(4_DIN)
NC: J123.1 RELAY1.4
NO: J123.3 RELAY1.5
QSPI_SCLK: U1.P$56(QSPI_SCLK) U2.P$6(SCLK) U3.6(CLK)
QSPI_SD0: U1.P$57(QSPI_SD0) U2.P$5(SI/SIO0) U3.5(DI(IO0))
QSPI_SD1: U1.P$59(QSPI_SD1) U2.P$2(SO/SIO1) U3.2(DO(IO1))
QSPI_SD2: U1.P$58(QSPI_SD2) U2.P$3(SIO2) U3.3(/WP(IO2))
QSPI_SD3: U1.P$55(QSPI_SD3) U2.P$7(SIO3) U3.7(/HOLD(IO3))
QSPI_SS: R1.1 R2.1 U1.P$60(QSPI_SS) U3.1(/CS)
SERVO: J1.1 P12.P$1 Q405.3(D) R329.1 R423.2
SWCLK: P5.P$1 U1.P$24(SWCLK)
SWDIO: P6.P$1 U1.P$25(SWD)
TFT_3V3 [PWR]: C47.2 C48.2 FB3.2 FPC1.P$2(VCC) FPC1.P$10(BL_A) FPC1.P$15(VCC) P23.P$1 R43.2 R44.2 R45.2 R46.2 R47.2
TFT_RST: C49.2 D001.+ FPC1.P$11(RESET) P13.P$1 R47.1
TYPE-C_N: J5.1 J8.3 R10.1
TYPE-C_P: J6.1 J8.2 R11.1
USB_D+ [USB]: R11.2 U1.P$52(USB_DP)
USB_D-: R10.2 U1.P$51(USB_DM)
V+: R276.2 RELAY1.1
V-: D002.+ LED1.- Q115.3(C) RELAY1.3
VBUS [PWR]: C5.2 C51.1 FB1.1 J4.1 J8.1 U41.4(EN) U41.5(VIN)
VCC [PWR]: C44.1 FB1.2 FB2.1 U41.1(VOUT)
VCC3V3 [PWR]: C29.1 C409.2 C412.2 C414.1 D143.1(1_A) FB4.1 L401.2 P1.P$1 P8.P$1 R411.2
VCC_3V3 [PWR]: C7.2 C10.1 C11.1 C12.1 C13.1 C16.1 C20.1 C21.1 C22.1 C23.1 C25.2 C31.2 C37.2 C41.2 C42.2 C43.2 C45.2 C46.1 C50.2 C64.2 C71.2 C213.2 C214.2 FB3.1 FB4.2 J14.P$4(4VCC) P2.3 P3.P$1 Q7.1(G) Q405.1(G) R1.2 R5.2 R9.1 R12.2 R14.2 R16.1 R18.1 R19.1 R57.2 R58.2 R59.2 R61.2 R62.3 R107.2 R301.1 R422.2 R639.1 U1.P$1(IOVDD5) U1.P$11(IOVDD4) U1.P$20(IOVDD3) U1.P$30(IOVDD2) U1.P$38(IOVDD1) U1.P$44(ADC_AVDD) U1.P$45(IOVDD0) U1.P$49(VREG_VIN) U1.P$53(USB_OTP_VDD) U1.P$54(QSPI_IOVDD) U2.P$8(VDD) U3.8(VCC) U5.1(VCC) U7.1(VCC) U11.8(8_VCC) U12.8(VLOGIC) U12.13(VDD) U123.5(VCC) U309.1
VCC_5V [PWR]: C6.2 C19.1 C33.2 C35.2 C38.2 C39.2 C66.1 C411.2 C413.1 FB2.2 J1.3 J2.2(H) J2.3(A) L11.1 P7.P$1 P10.P$1 R7.1 R20.1 R23.1 R63.2 R283.1 R303.1 R423.1 U6.1(VCC) U30.5(IN) U401.P$1(1_VIN)
VCC_IO_RGB: C8.1 C183.1 L2.2 P69.P$1 R76.2 R116.2 R118.1 U34.5(5_VIN)
VCC_RELAY: C36.2 D002.- L11.2 R24.2 R276.1
XIN: C1.2 U1.P$21(XIN) X1.1(XIN)
XOUT: R8.1 U1.P$22(XOUT)
Unconnected: BOOT.P$2 BOOT.P$3 D033.2(2_DOUT) FPC1.P$8(NC) J1.2 J110.3(3_2A) J110.4(4_1A) J110.6(6_1B) RESET.P$1 RESET.P$4 U11.5(5_IN2+) U11.6(6_IN2-) U11.7(7_OUT2) U12.6(AUX_DA) U12.7(AUX_CL) U12.12(INT)

## Notes on the sheet
- All-in-one Starter Kit for Pico 2  V1.0
- Buzeer | Ultrasonic Sensor | LIGHT SENSOR
- USB Adapter | Temperature & Humidity(DHT20) | PORT:I2C1   ADDR:0X5C
- PORT:GPIO10_BUZZER | PORT:GPIO9&8
- POWER IN :5V 1A
- PORT:I2C1    ADDRESS:0X38
- IN:2.5-6V
- Rotary  Potentiometer | Infrared Remote Sensor | GAS-MQ2
- POWER  5V drop 3.3V
- PORT:ADC_POT | PORT:GPIO11_IR | PORT:ADC_GAS
- 系统3.3v
- Vout=0.6x(1+R1/R2)
- RP2350A_MCU MIN System | HALL SENSOR | Servo motor
- PORT:GPIO13_SERVO
- PORT:GGPIO21_HALL
- RESET=0时，按下Boot下载模式
- Boot=1,正常运行
- Relay | Button
- PORT:GPIO12_RELAY | PORT:GP26_A0_PIR
- PSRAM
- Touch Sensor | Vibration sensor
- PORT:GPIO14_TOUCH | PORT:GPIO15_VIB
- NOR Flash
- TTP223
- SOUND_SENSOR | RGB_LED
- LED
- PORT:GP29_A3_SOUND
- PORT:GPIO23&22 | PORT:GPIO18&19&20
- 4.5V
- I=6.8/R1
- Vout=0.6x(1+R1/R2)
- MPU-6050
- PORT:I2C1   ADDR:0X68
- TFT2.4 Inch LCD+TP
- PIR SENEOR
- PORT:
- PORT:

## Library data of the parts
BOOT RESET = CKP:KEY
BUZ1 = Crowtail_Starter:BUZZER
C1-C51 C57 C64-C71 C90 C183 C212-C214 C409 C411-C414 = Brian:CAP*
D001 = CrowPanel_Advance_HMI:DIODE*
D002 D004 = Crowtail_Starter:DIODE*
D005 D006 D11 = Crowtail_Starter:LED: LED (Generic) Standard schematic elements and footprints for 5mm, 3mm, 1206, and 0603 sized LEDs. Generic LEDs with no color specified.
D007 = CKP-1:DIODE_DIODE-: DIODE
D012 D019 D021-D033 D183-D187 = cooper:LED_RGB_WS2812_3535
D143 = cooper:LED_0603_SMT
FB1 FB2 FB4 = Brian:R_120/100MHZ_3A
FB3 = Brian:R_600/100MHZ_0.5A
FPC1 = Brian:P024C128-CTP
J1 = CrowPanel ESP32 Display-4.3-inch-V2.1-20240314:A_XBJ_CONNECTOR_TWIG-4P-2.0-SMD-FEMALE-REINFORCE
J2 = Brian:MQ-SOCKET
J3 = Crowpi_laptop-MB-V1.0-20200623-01:TEMPLATE_MICROPHONE
J4-J7 = Crowtail_Starter:TP-SMD
J8 = CrowPanel ESP32 Display-4.3-inch-V2.1-20240314:PH2.0-4P-WOTIE
J14 = Crowtail_Starter_V0.2:CROWPI_POW_ULTRA
J110 = cooper:SWITCH_6PIN_2P
J123 = Crowtail_Starter:3.5MM*3P
J313 = crowpi_pow:MOTOR_1CN
K1-K4 = crowpi_pow:BUTTON_2P
L1 = CrowPanel_Advance_HMI:FTC201610S3R3MBCA
L2 = CD54:CD32_950MA
L11 = CrowPi2-MB-V1.4-20211012:CMP201209UD1R0MT
L401 = crowpi_pow:L-773
LED1 = A_xbj:DISCRETE_LED*
P1 P3-P24 P30 P53 P55 P61 P69 P70 = crowpi_pow:PAD*
P2 R62 = discrete:R-POTENTIOMETER*: Potentiometer
P101 = discrete:PAD
Q1-Q3 Q6 Q103 Q104 Q115 = discrete:TRANSISTOR-NPN*: NPN audion
Q5 = CrowPanel_Advance_HMI:TRANS_NPN: NPN transistor Current controlled devices typically used to amplify current or used as a switch. BC547 - COM-08928 <http://www.sparkfun.com/products/8928> (TO-92 45V 100mA) (1.Collector 2.Base 3.Emitter) 2N3904 - COM-00521 <http://www.sparkfun.com/products/521> (TO-92 40V 200mA) (1.Emitter 2.Base 3.Collector) P2N2222A - COM-12852 <http://www.sparkfun.com/products/12852> (TO-92 40V 600mA) (1.Collector 2.Base 3.Emitter)
Q7 Q405 = discrete:MOSFET-N: IRLL014: http://www.vishay.com/docs/91319/sihll014.pdf
R1-R29 R34-R36 R40-R47 R54 R56-R59 R61 R63 R76 R107 R115-R118 R190 R191 R273 R274 R276 R280 R282-R284 R286-R288 R299 R301-R303 R329 R411 R412 R422 R423 R622 R639 R652-R655 = Brian:RES*
RELAY1 = Discrete-new:RELAY-SRD
U1 = RP2350:RP2350A
U2 = Brian:APS6404L
U3 = CKP:W25QXX
U5 = Crowtail_Starter:CROWTAIL-DHT20-V1.0-20211013_DHT20
U6 = IC:A1101: Continuous-Time Switch
U7 = Crowtail_Starter:BH1750
U10 = MY_LIB:SN74LVC1G125
U11 = cooper:IC_LM393_SOP8
U12 = Testing:MPU-6050
U30 = MT2492:MT2492
U34 = cooper:LPW5206B5F_SOT23-5
U41 = MY_LIB:PW1503
U123 = Seeed:TTP223
U309 = Crowtail_Starter:IR-3P
U401 = cooper:TD1509: TD1509
X1 = CrowBot_V1.4:A_XBJ_XTAL

## Net classes
0 default: width 0.15 mm
1 PWR: width 0.15 mm, drill 0.25 mm
2 gnd: width 0.15 mm, drill 0.254 mm, clearance 0.152 mm to class 0, clearance 0.152 mm
4 USB: width 0.152 mm, clearance 0.152 mm